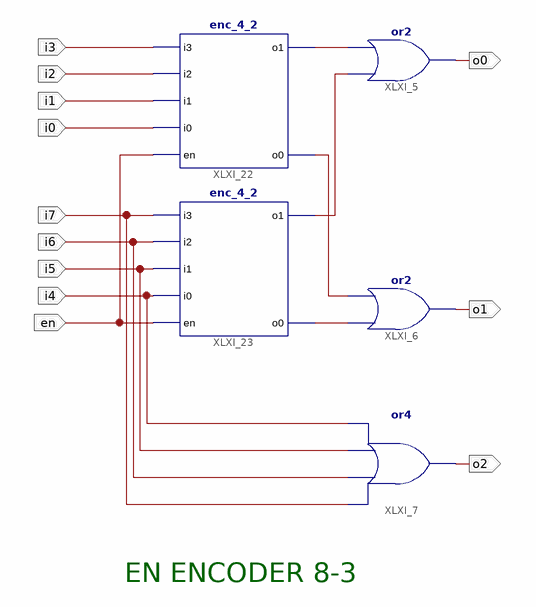
[diagram p0: schematic sheet 1]
// Xilinx ISE schematic enc_8_3.sch (spartan3e) as structural Verilog: 5 symbols, 12 ports
module enc_8_3 (
  input  i7,
  input  i6,
  input  i5,
  input  i4,
  input  en,
  input  i3,
  input  i2,
  input  i1,
  input  i0,
  output o2,
  output o0,
  output o1
);

  wire XLXN_1, XLXN_4, XLXN_18, XLXN_19;

  or XLXI_5 (o0, XLXN_19, XLXN_1);
  or XLXI_6 (o1, XLXN_4, XLXN_18);
  or XLXI_7 (o2, i7, i6, i5, i4);
  enc_4_2 XLXI_22 (.i3(i3), .i2(i2), .i1(i1), .i0(i0), .en(en), .o1(XLXN_1), .o0(XLXN_18));
  enc_4_2 XLXI_23 (.i3(i7), .i2(i6), .i1(i5), .i0(i4), .en(en), .o1(XLXN_19), .o0(XLXN_4));

  // Notes on the sheet:
  //   EN ENCODER 8-3
endmodule
